# EAGLE schematic usb-c_dlt (EAGLE 9.4.2)
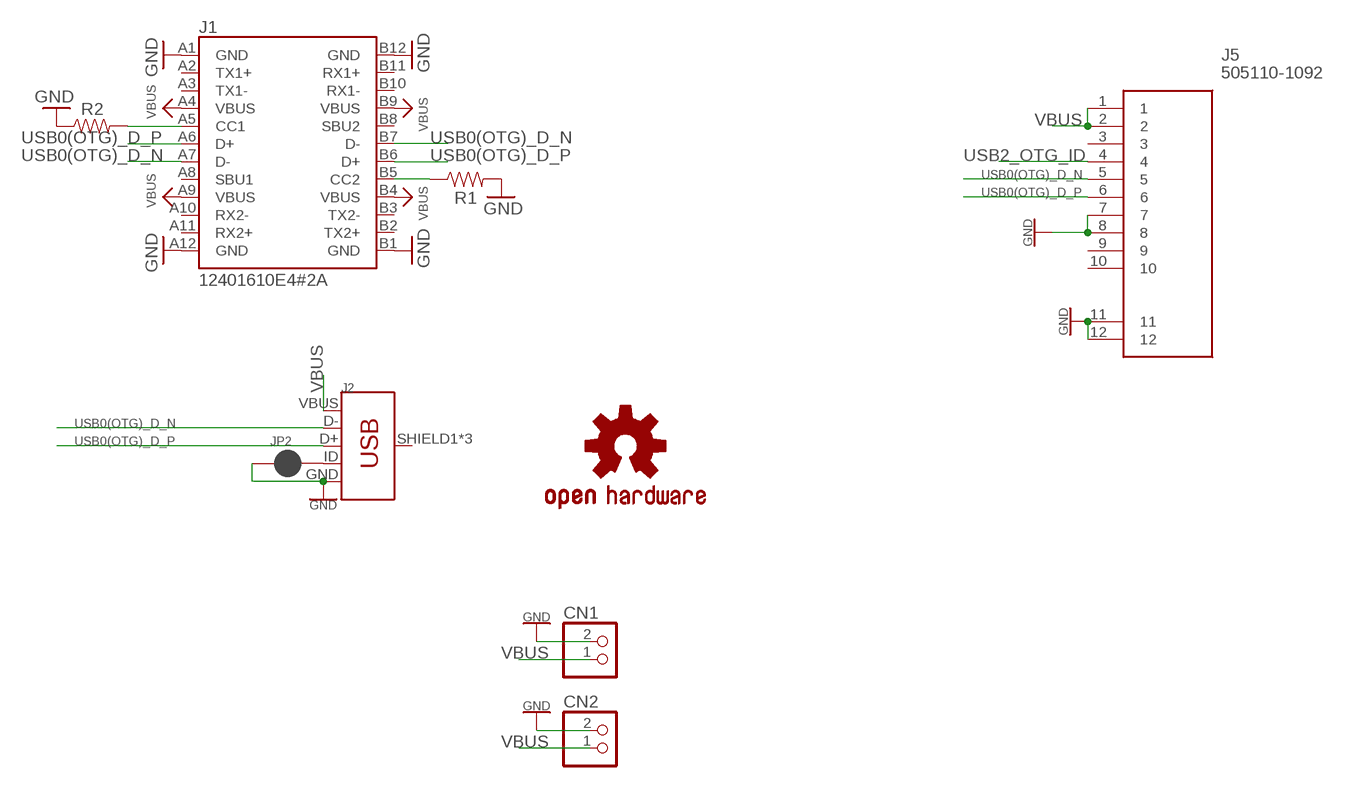
[diagram p0: schematic, sheet 1]

## Parts
CN1  JST_2PIN-SMT-RA  [JST-PH-2-SMT-RA]
CN2  JST_2PIN-SMT-RA  [JST-PH-2-SMT-RA]
J1  12401610E4#2A  [AMPHENOL_12401610E4#2A]
J2  USB_MICRO-B_FEMALE-SMT  [USB-B-MICRO-SMD]
J5  505110-1092  [5051101092]
JP2  JUMPER-SMT_2_NC_PASTE_NO-SILK  [SMT-JUMPER_2_NC_PASTE_NO-SILK]
LOGO1  OSHW-LOGOS-COPPER  [OSHW-LOGO-S_COPPER]
R1  RESISTOR0603  [0603]
R2  RESISTOR0603  [0603]

## Nets
A0/CC2: J1.A5(CC1) R2.2
A3/CC1: J1.B5(CC2) R1.1
GND: CN1.2 CN2.2 J1.A1(GND) J1.A12(GND) J1.B1(GND) J1.B12(GND) J2.GND J5.7 J5.8 J5.11 J5.12 JP2.1 R1.2 R2.1
N$2: J2.ID JP2.2
USB0(OTG)_D_N: J1.A7(D-) J1.B7(D-) J2.D- J5.5
USB0(OTG)_D_P: J1.A6(D+) J1.B6(D+) J2.D+ J5.6
USB2_OTG_ID: J5.4
VBUS: CN1.1 CN2.1 J1.A4(VBUS) J1.A9(VBUS) J1.B4(VBUS) J1.B9(VBUS) J2.VBUS J5.1 J5.2
Unconnected: J1.A2(TX1+) J1.A3(TX1-) J1.A8(SBU1) J1.A10(RX2-) J1.A11(RX2+) J1.B2(TX2+) J1.B3(TX2-) J1.B8(SBU2) J1.B10(RX1-) J1.B11(RX1+) J2.SHIELD1(SHIELD) J2.SHIELD2(SHIELD) J2.SHIELD3(SHIELD) J5.3 J5.9 J5.10

## Library data of the parts
CN1 CN2 = adafruit:JST_2PIN: JST 2-Pin Connectors of various flavors SMT-RA (S2B-PH-SM4) 4UConnector #17311 SMT (B2B-PH-SM4) THM-RA (S2B-PH) THM (B2B-PH)
J1 = 12401610E4_2A:12401610E4#2A: Usb Type-c, Ra Rcpt, Pcb Mount,; DESCRIPTION: Conn USB Type C Surface Mount Receptacle; DIGI-KEY_PART_NUMBER: 12401610E4#2ACT-ND; DIGI-KEY_PURCHASE_URL: https://www.digikey.fr/product-detail/en/amphenol-commercial-products/12401610E4-2A/12401610E4-2ACT-ND/5775520?WT.z_cid=ref_snapeda&utm_source=snapeda&utm_medium=aggregator&utm_campaign=buynow; MF: Amphenol; MP: 12401610E4#2A; PACKAGE: None
J2 = SparkFun-Connectors:USB_MICRO-B: USB Type Micro-B Connector Male/female and PTH/SMT variants SparkFun Products: SparkFun microB USB Breakout <https://www.sparkfun.com/products/12035> SparkFun USB microB Plug Breakout <https://www.sparkfun.com/products/10031> SparkFun ESP8266 Thing <https://www.sparkfun.com/products/13231>; PROD_ID: CONN-11752
J5 = SamacSys_Parts:505110-1092: Molex Easy-On Series 0.5mm Pitch 10 Way Right Angle SMT Male FPC Connector, ZIF Bottom Contact Source: Datasheet <https://componentsearchengine.com/Datasheets/1/505110-1092.pdf>; DESCRIPTION: Molex Easy-On Series 0.5mm Pitch 10 Way Right Angle SMT Male FPC Connector, ZIF Bottom Contact; HEIGHT: 0mm; MANUFACTURER_NAME: Molex; MANUFACTURER_PART_NUMBER: 505110-1092; MOUSER_PART_NUMBER: 538-505110-1092; MOUSER_PRICE-STOCK: https://www.mouser.com/Search/Refine.aspx?Keyword=538-505110-1092
JP2 = SparkFun-Jumpers:JUMPER-SMT_2_NC_PASTE: Normally closed solder jumper This jumper has an aperture in the stencil to allow solder paste to bridge the split in the wire so it's normally closed (NC). Wick off the solder to open the connection. Reapply solder to reclose the connection.
LOGO1 = SparkFun-Aesthetics:OSHW-LOGO: Open-Source Hardware (OSHW) Logo This logo indicates the piece of hardware it is found on incorporates a OSHW license and/or adheres to the definition of open source hardware found here: http://freedomdefined.org/OSHW
R1 R2 = SparkFun-Resistors:RESISTOR: Generic Resistor Package